# Altium project Fluide Control.PrjPcb
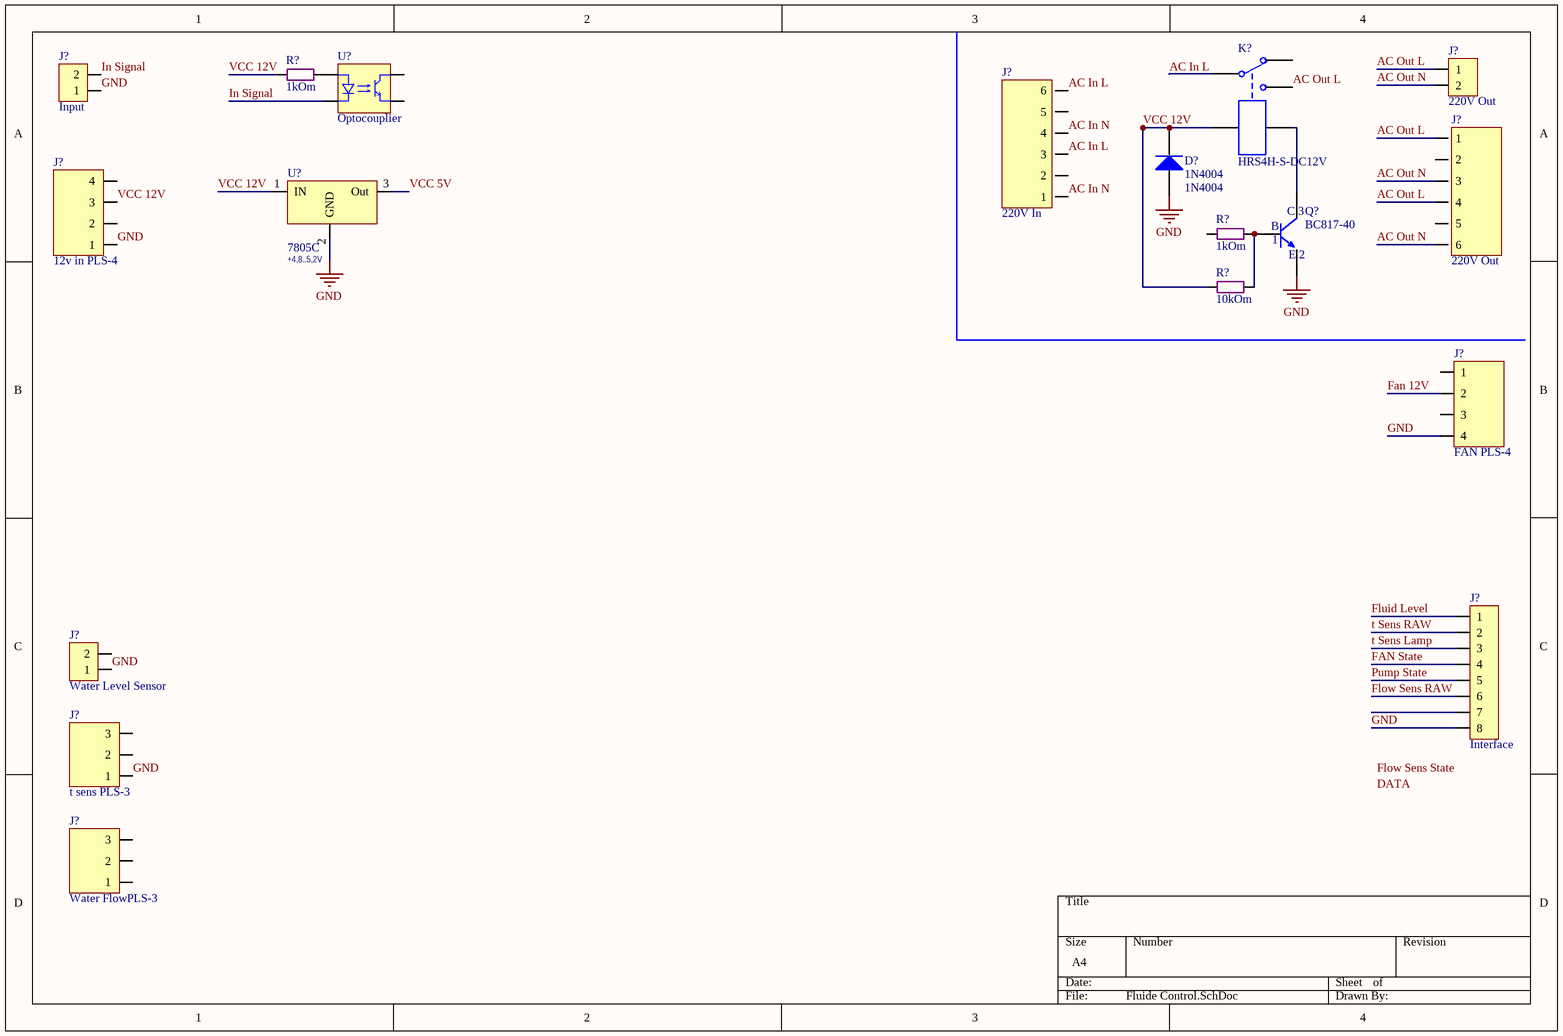
[diagram p0: Fluide Control.SchDoc]
1 sheet, 18 parts. Net scope: global (net labels, ports and power ports of the same name join across sheets).
Board file: Fluide Control.PcbDoc

## Sheet Fluide Control.SchDoc
size A4

### Parts
(Parts that share a designator on the sheet are numbered #1, #2 ... from top to bottom, then left to right.)
D?  1N4004  [Diode DO-35]
J?#1  220V Out  [DG301 5mm 2p]
J?#2  Input  [Molex Micro-Fit 3.0 - 2 pin D R]
J?#3  220V Out  [Molex Mini-Fit Jr - 6Pin R]
J?#4  220V In  [Molex Mini-Fit Jr - 6Pin R]
J?#5  12v in PLS-4  [Line 2.54 X 4]
J?#6  FAN PLS-4  [Line 2.54 X 4]
J?#7  Interface  [Molex Micro-Fit 3.0 - 8 pin D R]
J?#8  Water Level Sensor  [CWF-2]
J?#9  t sens PLS-3  [Line 2.54 X 3]
J?#10  Water FlowPLS-3  [Line 2.54 X 3]
K?  HRS4H-S-DC12V  [Relay Type C]
Q?  BC817-40  [SOT-23]
R?#1  1kOm  [SMD 0805 (2012)]
R?#2  1kOm  [SMD 0805 (2012)]
R?#3  10kOm  [SMD 0805 (2012)]
U?#1  Optocouplier  [DIP-4]
U?#2  7805C  V Out: +4,8..5,2V  [D-PAK]

### Nets
GND: D?.A J?#2.1 J?#5.1 J?#6.4 J?#7.8 J?#8.1 J?#9.1 Q?.2(E) U?#2.2(GND)
AC In L: J?#4.3 J?#4.6 K?.2
AC In N: J?#4.1 J?#4.4
AC Out L: J?#1.1 J?#3.1 J?#3.4 K?.3
AC Out N: J?#1.2 J?#3.3 J?#3.6
Fan 12V: J?#6.2
FAN State: J?#7.4
Flow Sens RAW: J?#7.6
Fluid Level: J?#7.1
In Signal: J?#2.2 U?#1.2
Pump State: J?#7.5
t Sens Lamp: J?#7.3
t Sens RAW: J?#7.2
VCC 5V: U?#2.3(Out)
VCC 12V: D?.K J?#5.3 K?.4 R?#1.1 R?#3.1 U?#2.1(IN)
NetK?_5: K?.5 Q?.3(C)
NetQ?_1: Q?.1(B) R?#2.2 R?#3.2
NetR?#1_2: R?#1.2 U?#1.1

Not connected (* = marked no-connect by the designer): J?#3 2 5; J?#4 2 5; J?#5 2 4; J?#6 1 3; J?#7 7; J?#8 2; J?#9 2 3; J?#10 1 2 3; K? 1; R?#2 1; U?#1 3 4

### Notes on the sheet
- Labels drawn without touching a wire or pin: DATA, Flow Sens State
- (in symbol BC817-40) C 3; E 2

### Library data of the parts
D? = Diode 1N4004: 1 Amp General Purpose Rectifier; PackageReference: DO-41; PackageDescription: Diode, Axial; Body 5.2 x 2.7 mm (LxDia. max), Lead Dia. 0.86 mm (max); Code_JEDEC: DO-204-AL; ComponentLink1Description: Manufacturer Link; ComponentLink1URL: http://www.fairchildsemi.com/; ComponentLink2Description: Datasheet; ComponentLink2URL: http://www.fairchildsemi.com/ds/1N%2F1N4001.pdf; VALUE: 1N4004
J?#1 = DG301-5.0-2P12: DG301 series
J?#2 = Micro-Fit 2R (1x2): Horisontal, Dbl line, Male - 3mm; Part Number: 430450200; Name: Micro-Fit 3.0; URL: http://www.molex.com/molex/products/datasheet.jsp?part=active/0430450200_PCB_HEADERS.xml
J?#3 J?#4 = Molex Mini-Fit Jr - 6 pin - R: Right, Dbl line, Female
J?#5 J?#6 = PLS-4: Vert, Sgl line, Male
J?#7 = Micro-Fit 8R (2x4): Horisontal, Dbl line, Male - 3mm
J?#8 = CWF-2 (R): CWF series
J?#9 J?#10 = PLS-3: Vert, Sgl line, Male
K? = HRS4H-S-DC12V: Single-Pole Relay 12V 10A; R обм: 240 Om; Name: HRS4H-S-DC12V; I (DC = 28 V): 10A; I (AC = 240 V): 10A; U: 12 V
Q? = BC817-40: NPN 45 V, 500 mA NPN general-purpose transistor; type: 45 V, 500 mA NPN general-purpose transistors; Name: BC817-40; url: http://lib.chipdip.ru/156/DOC000156781.pdf
R?#1-R?#3 = Res All Types
U?#1 = Optocouplier LTV 817B: LTV817 Datasheet: http://lib.chipdip.ru/222/DOC000222300.pdf; Name: LTV817B
U?#2 = 7805C: Voltage Regulator; Manufacturer: Интеграл; I output (A): 1; Max Voltage In (V): 35; Напряжение выход-вход (dropout): >2V; t: -10..+70°C; Case: D2PAK; Shema: http://tec.org.ru/_bd/5/57349922.jpg; Name: 7805C